# EAGLE design TeleinfoMySensorsRFM (EAGLE 9.6.2)
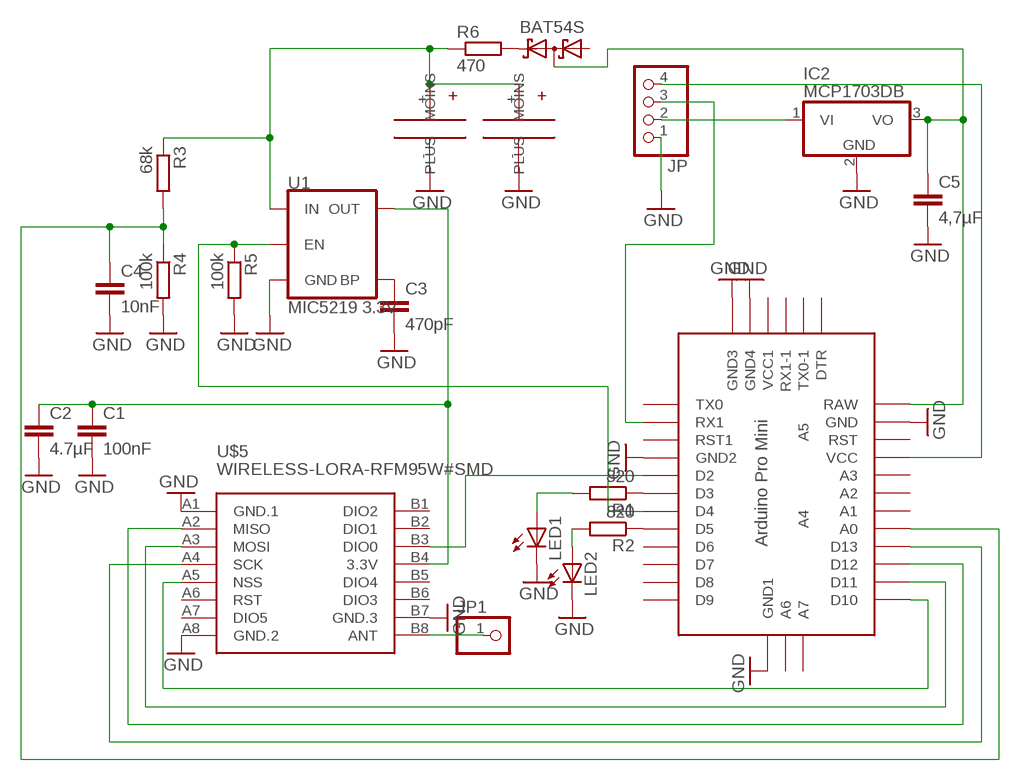
[diagram p0: schematic, sheet 1]

## Parts
C1  100nF  C-EUC1206  [C1206]
C2  4.7µF  C-EUC1210  [C1210]
C3  470pF  C-EUC1206  [C1206]
C4  10nF  C-EUC1206  [C1206]
C5  4,7µF  C-EUC1210  [C1210]
D3  BAT54S  [SOT23]
IC2  MCP1703DB  [SOT223]
JP  PINHD-1X4  [1X04]
JP1  PINHD-1X1  [1X01]
LED1  LED3MM  [LED3MM]
LED2  LED3MM  [LED3MM]
R1  820  R-EU_M1206  [M1206]
R2  820  R-EU_M1206  [M1206]
R3  68k  R-EU_M1206  [M1206]
R4  100k  R-EU_M1206  [M1206]
R5  100k  R-EU_M1206  [M1206]
R6  470  R-EU_M1206  [M1206]
U1  MIC5219 3.3V  V_REG_MIC52193.3V  [SOT23-5]
U$1  ABK-PRO-MINI  [ABK-PRO-MINI]
U$2  SUPERCAPA10  [SUPERCAPA10]
U$5  WIRELESS-LORA-RFM95W#SMD  [WIRELESS-LORA-RFM95W#SMD]
U$6  SUPERCAPA10  [SUPERCAPA10]

## Nets
GND: C1.2 C2.2 C3.2 C4.2 C5.2 IC2.2(GND) JP.1 LED1.K(C) LED2.K(C) R4.2 R5.2 U1.2(GND) U$1.GND U$1.GND1(GND2) U$1.GND2(GND3) U$1.GND3(GND4) U$1.GND4(GND1) U$2.-(MOINS) U$5.A1(GND.1) U$5.A8(GND.2) U$5.B7(GND.3) U$6.-(MOINS)
N$1: JP1.1 U$5.B8(ANT)
N$2: LED2.A R2.2
N$3: U$1.D12 U$5.A2(MISO)
N$4: R1.1 U$1.D3
N$5: IC2.1(VI) JP.2
N$6: U$1.D11 U$5.A3(MOSI)
N$7: U$1.D13 U$5.A4(SCK)
N$8: U$1.D10 U$5.A5(NSS)
N$9: R2.1 U$1.D5
N$10: U$1.D2 U$5.B3(DIO0)
N$11: LED1.A R1.2
N$12: JP.3 U$1.RX1
N$13: C3.1 U1.4(BP)
N$14: C5.1 D3.3(C1A2) IC2.3(VO) U$1.RAW
N$15: R5.1 U1.3(EN) U$1.D4
N$16: C4.1 R3.2 R4.1 U$1.A0
N$17: C1.1 C2.1 U1.5(OUT) U$5.B4(3.3V)
N$18: JP.4 U$1.VCC
N$19: D3.2(C2) R6.2
N$20: R3.1 R6.1 U1.1(IN) U$2.+(PLUS) U$6.+(PLUS)
Unconnected: D3.1(A1) U$1.A1 U$1.A2 U$1.A3 U$1.A4 U$1.A5 U$1.A6 U$1.A7 U$1.D6 U$1.D7 U$1.D8 U$1.D9 U$1.DTR U$1.RST U$1.RST1 U$1.RX1-1 U$1.TX0 U$1.TX0-1 U$1.VCC1 U$5.A6(RST) U$5.A7(DIO5) U$5.B1(DIO2) U$5.B2(DIO1) U$5.B5(DIO4) U$5.B6(DIO3)

## Library data of the parts
C1-C5 = rcl:C-EU: CAPACITOR, European symbol
D3 = diode:BAT54S: Schottky Diodes Pin connection corrected 2011-05-04 Source: Fairchild .. BAT54.pdf
IC2 = linear:MCP1703: 250 mA, 16V, Low Quiescent Current LDO Regulator Source: http://ww1.microchip.com/downloads/en/DeviceDoc/22049b.pdf
JP = pinhead:PINHD-1X4: PIN HEADER
JP1 = pinhead:PINHD-1X1: PIN HEADER
LED1 LED2 = led:LED: LED OSRAM: - CHIPLED LG R971, LG N971, LY N971, LG Q971, LY Q971, LO R971, LY R971 LH N974, LH R974 LS Q976, LO Q976, LY Q976 LO Q996 - Hyper CHIPLED LW Q18S LB Q993, LB Q99A, LB R99A - SideLED LS A670, LO A670, LY A670, LG A670, LP A670 LB A673, LV A673, LT A673, LW A673 LH A674 LY A675 LS A676, LA A676, LO A676, LY A676, LW A676 LS A679, LY A679, LG A679 - Hyper Micro SIDELED® LS Y876, LA Y876, LO Y876, LY Y876 LT Y87S - SmartLED LW L88C, LW L88S LB L89C, LB L89S, LG L890 LS L89K, LO L89K, LY L89K LS L896, LA L896, LO L896, LY L896 - TOPLED LS T670, LO T670, LY T670, LG T670, LP T670 LSG T670, LSP T670, LSY T670, LOP T670, LYG T670 LG T671, LOG T671, LSG T671 LB T673, LV T673, LT T673, LW T673 LH T674 LS T676, LA T676, LO T676, LY T676, LB T676, LH T676, LSB T676, LW T676 LB T67C, LV T67C, LT T67C, LS T67K, LO T67K, LY T67K, LW E67C LS E67B, LA E67B, LO E67B, LY E67B, LB E67C, LV E67C, LT E67C LW T67C LS T679, LY T679, LG T679 LS T770, LO T770, LY T770, LG T770, LP T770 LB T773, LV T773, LT T773, LW T773 LH T774 LS E675, LA E675, LY E675, LS T675 LS T776, LA T776, LO T776, LY T776, LB T776 LHGB T686 LT T68C, LB T68C - Hyper Mini TOPLED® LB M676 - Mini TOPLED Santana® LG M470 LS M47K, LO M47K, LY M47K Source: http://www.osram.convergy.de LUXEON: - LUMILED® LXK2-PW12-R00, LXK2-PW12-S00, LXK2-PW14-U00, LXK2-PW14-V00 LXK2-PM12-R00, LXK2-PM12-S00, LXK2-PM14-U00 LXK2-PE12-Q00, LXK2-PE12-R00, LXK2-PE12-S00, LXK2-PE14-T00, LXK2-PE14-U00 LXK2-PB12-K00, LXK2-PB12-L00, LXK2-PB12-M00, LXK2-PB14-N00, LXK2-PB14-P00, LXK2-PB14-Q00 LXK2-PR12-L00, LXK2-PR12-M00, LXK2-PR14-Q00, LXK2-PR14-R00 LXK2-PD12-Q00, LXK2-PD12-R00, LXK2-PD12-S00 LXK2-PH12-R00, LXK2-PH12-S00 LXK2-PL12-P00, LXK2-PL12-Q00, LXK2-PL12-R00 Source: www.luxeon.com KINGBRIGHT: KA-3528ASYC Source: www.kingbright.com
R1-R6 = rcl:R-EU_: RESISTOR, European symbol
U1 = SparkFun-IC-Power:V_REG_MIC5219: V_REG MIC5219 Standard 3.3V and 5V 500mA LDO voltage regulator in SOT-23 layout. Micrel part MIC5219. BP (by-pass) pin is used to lower output noise with 470pF cap, may be left open.; PROD_ID: VREG-09872
U$1 = Arduino-clone:ABK-PRO-MINI: ABK Pro-Mini Arduino Clone
U$2 U$6 = SuperCapa:SUPERCAPA10
U$5 = diy-modules:WIRELESS-LORA-RFM95W: 868/915 MHz LoRa Radio Transceiver Module based on SX1276 chip Click here to find device on ebay.com <http://www.ebay.com/sch/RFM95W+transceiver>

## Board
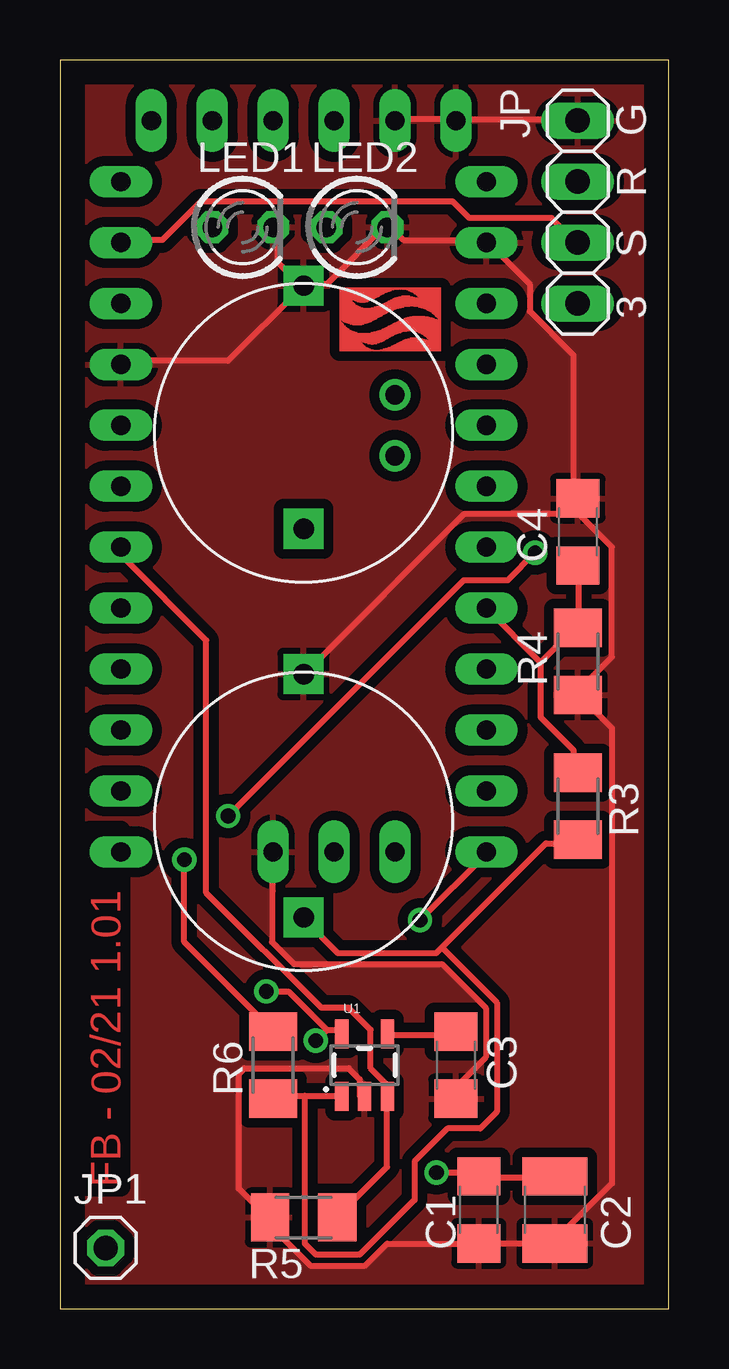
[diagram p1: board, top side]
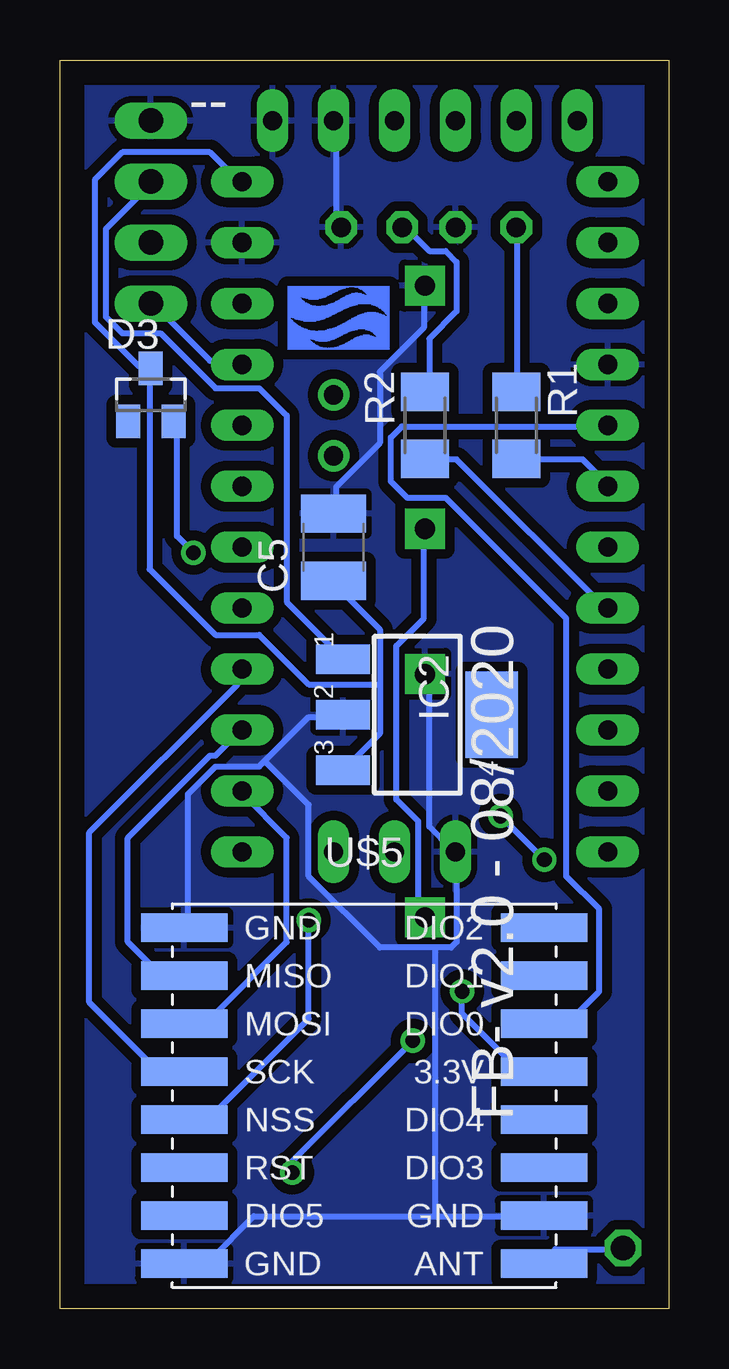
[diagram p2: board, bottom side, seen from below]

Size 25.38 x 52.06 mm. Coordinates in mm from the lower left corner, seen from the top.
Outline: 0,0 25.38,0 25.38,52.06 0,52.06 0,0
Copper layers (1*16): Top 0.035mm / dielectric 1.5mm / Bottom 0.035mm
Design rules "default": minimum track width 10mil, minimum drill 24mil, track to track 8mil, track to pad 8mil, pad to pad 8mil, via to via 8mil, smd to smd 8mil, copper to edge 40mil, drill to drill 8mil, minimum pad ring 10mil, minimum via ring 8mil, stop-mask expansion 4mil, vias tented up to drill 0mil, thermal gap 10mil

### Footprints (pad centres in the part's own frame; a part is rotated, then mirrored left to right if it is on the bottom)
C1206 = smd 1.6 x 1.8: 1 -1.4,0; 2 1.4,0
C1210 = smd 1.6 x 2.7: 1 -1.4,0; 2 1.4,0
SOT23 = smd 1 x 1.4: 1 -0.95,-1.1; 2 0.95,-1.1; 3 0,1.1
SOT223 = smd 1.219 x 2.235: 1 -2.311,-3.099; 2 0,-3.099; 3 2.311,-3.099 | smd 3.6 x 2.2: 4 0,3.099
1X04 = drill 1.016 long: 1 -3.81,0; 2 -1.27,0; 3 1.27,0; 4 3.81,0
1X01 = drill 1.016 octagon: 1 0,0
LED3MM = drill 0.813 octagon: A -1.27,0; K 1.27,0
M1206 = smd 1.6 x 2: 1 -1.4,0; 2 1.4,0
SOT23-5 = smd 0.55 x 1.2: 1 -0.95,-1.3; 2 0,-1.3; 3 0.95,-1.3; 4 0.95,1.3; 5 -0.95,1.3
ABK-PRO-MINI = drill 0.8 long: A0 10.16,-11.43; A1 10.16,-8.89; A2 10.16,-6.35; A3 10.16,-3.81; A6 3.81,-21.59; A7 6.35,-21.59; D2 -5.08,-3.81; D3 -5.08,-6.35; D4 -5.08,-8.89; D5 -5.08,-11.43; D6 -5.08,-13.97; D7 -5.08,-16.51; D8 -5.08,-19.05; D9 -5.08,-21.59; D10 10.16,-21.59; D11 10.16,-19.05; D12 10.16,-16.51; D13 10.16,-13.97; DTR -3.81,8.89; GND 10.16,3.81; GND1 -5.08,-1.27; GND2 8.89,8.89; GND3 6.35,8.89; GND4 1.27,-21.59; RAW 10.16,6.35; RST 10.16,1.27; RST1 -5.08,1.27; RX1 -5.08,3.81; RX1-1 1.27,8.89; TX0 -5.08,6.35; TX0-1 -1.27,8.89; VCC 10.16,-1.27; VCC1 3.81,8.89 | drill 0.8: A4 6.35,-5.08; A5 6.35,-2.54
SUPERCAPA10 = drill 0.85 pad 1.676 square: + -4,0; - 6.14,0
WIRELESS-LORA-RFM95W#SMD = smd 3.6 x 1.2: A1 -7.5,7; A2 -7.5,5; A3 -7.5,3; A4 -7.5,1; A5 -7.5,-1; A6 -7.5,-3; A7 -7.5,-5; A8 -7.5,-7; B1 7.5,7; B2 7.5,5; B3 7.5,3; B4 7.5,1; B5 7.5,-1; B6 7.5,-3; B7 7.5,-5; B8 7.5,-7

### Placement (x,y rotation side)
C1  17.46,4.13 270 top
C2  20.64,4.13 270 top
C3  16.51,10.16 270 top
C4  21.59,32.38 90 top
C5  13.97,31.75 90 bottom
D3  21.59,38.1 0 bottom
IC2  10.48,24.77 270 bottom
JP  21.59,45.72 270 top
JP1  1.91,2.54 0 top
LED1  7.62,45.09 0 top
LED2  12.38,45.09 0 top
R1  6.35,36.83 90 bottom
R2  10.16,36.83 90 bottom
R3  21.59,20.95 90 top
R4  21.59,26.99 270 top
R5  10.16,3.81 180 top
R6  8.89,10.16 90 top
U1  12.7,10.16 0 top
U$1  7.62,40.64 0 top
U$2  10.16,20.32 90 top
U$3  [FB]  15.88,40.01 90 top
U$4  [FB]  15.88,42.55 270 bottom
U$5  12.7,8.89 0 bottom
U$6  10.16,36.51 90 top

### Tracks (layer width: path | path; a pad name or v marks a point on that pad's centre or on a via)
GND
  Top 0.254: C3.2 16.61,8.89 16.61,9.35 17.75,10.49 17.75,12.55 15.93,14.38 9.75,14.38 8.84,15.29 8.84,18.95 U$1.GND4 | U$1.GND1 2.67,39.52 7.01,39.52 9.98,42.49 U$6.- | LED1.K 9.07,45.01 9.07,43.64 9.98,42.72 U$6.- | U1.2 12.5,8.89 12.5,9.58 12.04,10.03 7.7,10.03 7.47,9.8 7.47,5 8.61,3.86 R5.2 8.61,3.63 10.44,1.8 12.72,1.8 13.64,2.72 17.3,2.72 C1.2 17.53,2.72 20.5,2.72 C2.2 20.73,2.95 23.01,5.23 23.01,24.21 21.64,25.58 R4.2 21.64,25.81 23.01,27.18 23.01,31.75 21.64,33.12 | 21.64,33.12 21.64,33.58 C4.2 | U$1.GND3 14.1,49.58 16.38,49.58 U$1.GND2 16.61,49.58 21.41,49.58 JP.1 | C4.2 21.41,33.81 21.41,39.75 19.58,41.58 19.58,42.72 17.98,44.32 U$1.GND 17.75,44.55 14.33,44.55 13.87,45.01 LED2.K 13.64,45.24 11.12,42.72 10.21,42.72 U$6.- | 21.64,33.12 16.84,33.12 10.21,26.49 U$2.- | 21.64,33.12 C4.2
  Bottom 0.254: 9.75,3.86 17.3,3.86 19.13,2.03 20.04,2.03 U$5.A8 | 9.75,3.86 5.41,3.86 U$5.B7 | 16.84,22.84 17.07,22.61 18.9,22.61 20.04,21.46 20.04,15.98 U$5.A1 | 16.84,22.84 15.01,24.66 13.64,24.66 IC2.2 | U$2.- 9.98,26.26 9.98,20.09 9.07,19.18 U$1.GND4 8.84,18.95 8.84,15.29 9.07,15.06 9.75,15.06 | 16.84,22.84 15.01,21.01 15.01,18.03 12.04,15.06 9.75,15.06 | 9.75,15.06 9.75,3.86 | C5.2 13.87,33.35 13.87,34.27 12.04,36.09 12.04,39.06 10.21,40.89 10.21,42.49 U$6.- | LED2.K 13.87,45.24 13.87,49.35 U$1.GND3
  pour Top (isolate 0.406): 0,52.07 25.4,52.07 25.4,0 0,0
  pour Bottom (isolate 0.406): 0,52.07 25.4,52.07 25.4,0 0,0
N$1
  Bottom 0.254: JP1.1 1.98,2.49 4.72,2.49 5.18,2.03 U$5.B8
N$2
  Bottom 0.254: R2.2 9.98,38.38 9.98,40.44 8.84,41.58 8.84,43.64 9.3,44.09 9.98,44.09 10.9,45.01 LED2.A
N$3
  Bottom 0.254: U$1.D12 17.98,23.98 18.9,23.06 19.13,23.06 22.55,19.63 22.55,15.29 21.18,13.92 20.27,13.92 U$5.A2
N$4
  Bottom 0.254: R1.1 6.33,35.41 3.58,35.41 2.67,34.49 U$1.D3
N$5
  Bottom 0.254: IC2.1 13.64,27.18 15.93,29.46 15.93,37.24 17.07,38.38 18.9,38.38 21.18,40.66 22.78,40.66 23.47,41.35 23.47,45.01 21.64,46.84 JP.2
N$6
  Bottom 0.254: U$1.D11 17.75,21.46 15.93,19.63 15.93,15.29 19.13,12.09 20.04,12.09 U$5.A3
N$7
  Bottom 0.254: U$1.D13 17.98,26.49 17.98,26.04 24.15,19.86 24.15,12.78 21.41,10.03 20.27,10.03 U$5.A4
N$8  (via drill 0.61)
  Top 0.254: v15.01,16.2 17.75,18.95 U$1.D10
  Bottom 0.254: v15.01,16.2 15.01,12.09 19.13,7.98 20.04,7.98 U$5.A5
N$9
  Bottom 0.254: R2.1 9.98,35.41 8.84,35.41 2.67,29.23 U$1.D5
N$10
  Bottom 0.254: U$1.D2 2.67,36.78 11.12,36.78 11.58,36.32 11.58,34.49 10.9,33.81 9.3,33.81 4.27,28.78 4.27,18.03 2.9,16.66 2.9,13.23 4.04,12.09 5.18,12.09 U$5.B3
N$11
  Bottom 0.254: R1.2 6.33,38.38 6.33,45.01 LED1.A
N$12
  Top 0.254: U$1.RX1 2.67,44.55 4.27,44.55 5.87,46.15 16.38,46.15 17.07,45.47 20.5,45.47 21.41,44.55 JP.3
N$13
  Top 0.254: U1.4 13.87,11.4 16.38,11.4 C3.1
N$14
  Bottom 0.254: 12.04,26.04 12.04,28.32 13.87,30.15 C5.1 | 12.04,26.04 12.04,23.98 13.41,22.61 IC2.3 | U$1.RAW 17.98,47.07 19.13,48.21 22.78,48.21 23.93,47.07 23.93,41.12 22.1,39.29 21.64,39.29 D3.3 21.64,39.06 21.64,30.84 18.9,28.09 17.07,28.09 15.01,26.04 12.04,26.04
N$15
  Top 0.254: R5.1 11.58,3.86 13.64,5.92 13.64,8.66 U1.3 13.64,8.89 13.64,9.35 12.95,10.03 12.95,11.63 12.04,12.55 10.9,12.55 6.1,17.35 6.1,27.86 2.67,31.29 2.67,31.75 U$1.D4
N$16
  Top 0.254: C4.1 21.64,30.84 21.64,28.55 R4.1 21.41,28.32 20.04,26.95 | 20.04,26.95 20.04,24.66 21.41,23.29 21.41,22.38 R3.2 | 20.04,26.95 U$1.A0
N$17  (via drill 0.61)
  Top 0.254: C2.1 20.5,5.46 17.53,5.46 C1.1 17.3,5.69 v15.7,5.69 | 11.12,11.63 11.58,11.63 U1.5 | 11.12,11.63 9.53,13.23 v8.61,13.23 | 11.12,11.63 v10.67,11.18
  Bottom 0.254: v8.61,13.23 8.61,12.32 6.33,10.03 5.41,10.03 U$5.B4 | v15.7,5.69 15.7,6.15 v10.67,11.18
N$18
  Bottom 0.254: U$1.VCC 17.98,39.52 19.13,39.52 21.41,41.81 JP.4
N$19  (via drill 0.61)
  Top 0.254: v19.81,31.52 18.67,30.38 16.84,30.38 v7.01,20.55 | v5.18,18.72 5.18,15.29 8.84,11.63 R6.2
  Bottom 0.254: v19.81,31.52 20.5,32.21 20.5,36.78 D3.2 | v5.18,18.72 v7.01,20.55
N$20
  Top 0.254: 10.21,8.89 9.07,8.89 R6.1 | 10.21,8.89 11.58,8.89 U1.1 | 15.93,15.06 15.7,14.83 11.58,14.83 10.21,16.2 U$2.+ | 15.93,15.06 20.27,19.41 21.41,19.41 R3.1 | 10.21,8.89 10.21,2.72 10.67,2.26 12.5,2.26 14.78,4.55 14.78,6.15 16.15,7.52 17.53,7.52 18.21,8.2 18.21,12.78 15.93,15.06
  Bottom 0.254: U$6.+ 10.21,32.44 10.21,28.78 11.35,27.63 11.35,21.23 10.44,20.32 10.44,16.66 10.21,16.43 U$2.+

### Text on the board
Top: FB - 02/21 1.01
tNames: G | R | S | 3
bNames: -- | FB- v2.0 - 08/2020